# EAGLE schematic ultra-flowmeter (EAGLE 9.6.2)
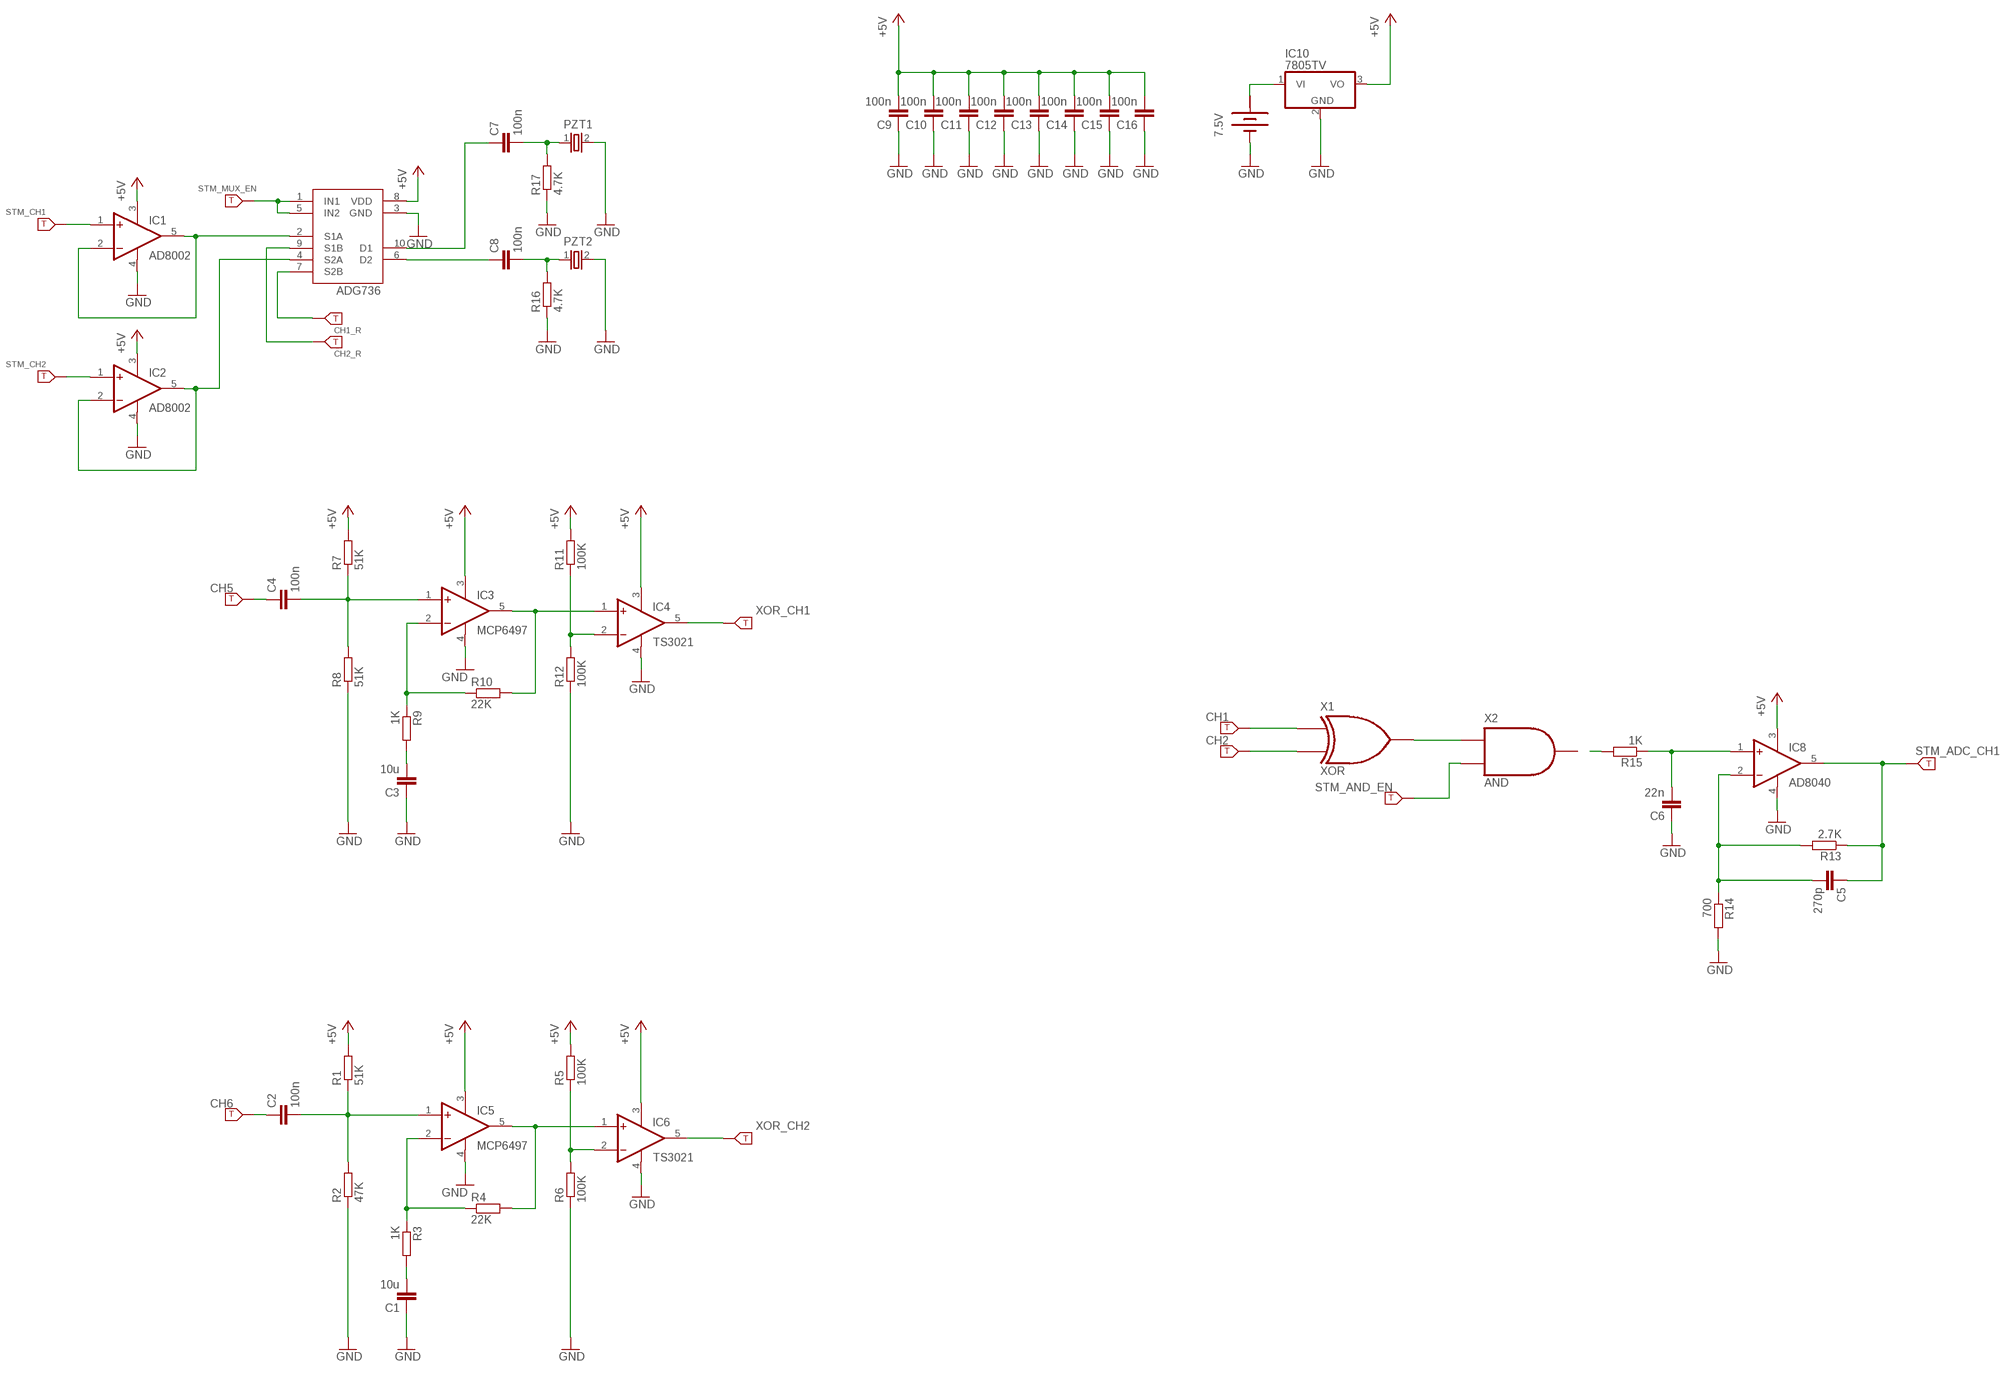
[diagram p0: schematic, sheet 1]

## Parts
7.5V  BATTERY  [BATTERY]
ADG736  ADG736  [MSOP10]
C1  10u  C-EU025-025X050  [C025-025X050]
C2  100n  C-EU025-025X050  [C025-025X050]
C3  10u  C-EU025-025X050  [C025-025X050]
C4  100n  C-EU025-025X050  [C025-025X050]
C5  270p  C-EU025-025X050  [C025-025X050]
C6  22n  C-EU025-025X050  [C025-025X050]
C7  100n  C-EU025-025X050  [C025-025X050]
C8  100n  C-EU025-025X050  [C025-025X050]
C9  100n  C-EU025-025X050  [C025-025X050]
C10  100n  C-EU025-025X050  [C025-025X050]
C11  100n  C-EU025-025X050  [C025-025X050]
C12  100n  C-EU025-025X050  [C025-025X050]
C13  100n  C-EU025-025X050  [C025-025X050]
C14  100n  C-EU025-025X050  [C025-025X050]
C15  100n  C-EU025-025X050  [C025-025X050]
C16  100n  C-EU025-025X050  [C025-025X050]
CH1  PAD1  [PAD1]
CH1_R  PAD1  [PAD1]
CH2  PAD1  [PAD1]
CH2_R  PAD1  [PAD1]
CH5  PAD1  [PAD1]
CH6  PAD1  [PAD1]
IC1  AD8002  [SO8]
IC2  AD8002  [SO8]
IC3  MCP6497  [SO8]
IC4  TS3021  [SO8]
IC5  MCP6497  [SO8]
IC6  TS3021  [SO8]
IC8  AD8040  [SO8]
IC10  7805TV  [TO220V]
PZT1  CRYSTAL  [CRYSTAL]
PZT2  CRYSTAL  [CRYSTAL]
R1  51K  R-EU_0207/10  [0207/10]
R2  47K  R-EU_0207/10  [0207/10]
R3  1K  R-EU_0207/10  [0207/10]
R4  22K  R-EU_0207/10  [0207/10]
R5  100K  R-EU_0207/10  [0207/10]
R6  100K  R-EU_0207/10  [0207/10]
R7  51K  R-EU_0207/10  [0207/10]
R8  51K  R-EU_0207/10  [0207/10]
R9  1K  R-EU_0207/10  [0207/10]
R10  22K  R-EU_0207/10  [0207/10]
R11  100K  R-EU_0207/10  [0207/10]
R12  100K  R-EU_0207/10  [0207/10]
R13  2.7K  R-EU_0207/10  [0207/10]
R14  700  R-EU_0207/10  [0207/10]
R15  1K  R-EU_0207/10  [0207/10]
R16  4.7K  R-EU_0207/10  [0207/10]
R17  4.7K  R-EU_0207/10  [0207/10]
STM_ADC_CH1  PAD1  [PAD1]
STM_AND_EN  PAD1  [PAD1]
STM_CH1  PAD1  [PAD1]
STM_CH2  PAD1  [PAD1]
STM_MUX_EN  PAD1  [PAD1]
X1  XOR  (no package)
X2  AND  (no package)
XOR_CH1  PAD1  [PAD1]
XOR_CH2  PAD1  [PAD1]

## Nets
+5V: ADG736.8(VDD) C9.2 C10.2 C11.2 C12.2 C13.2 C14.2 C15.2 C16.2 IC1.3(OFF1) IC2.3(OFF1) IC3.3(OFF1) IC4.3(OFF1) IC5.3(OFF1) IC6.3(OFF1) IC8.3(OFF1) IC10.3(VO) R1.2 R5.2 R7.2 R11.2
GND: 7.5V.- ADG736.3(GND) C1.1 C3.1 C6.1 C9.1 C10.1 C11.1 C12.1 C13.1 C14.1 C15.1 C16.1 IC1.4(OFF2) IC2.4(OFF2) IC3.4(OFF2) IC4.4(OFF2) IC5.4(OFF2) IC6.4(OFF2) IC8.4(OFF2) IC10.2(GND) PZT1.2 PZT2.2 R2.1 R6.1 R8.1 R12.1 R14.2 R16.1 R17.1
N$1: C2.2 IC5.1(+IN) R1.1 R2.2
N$2: IC2.1(+IN) STM_CH2.1
N$3: IC5.2(-IN) R3.1 R4.1
N$4: IC5.5(OUT) IC6.1(+IN) R4.2
N$5: IC6.2(-IN) R5.1 R6.2
N$6: C4.2 IC3.1(+IN) R7.1 R8.2
N$7: IC3.2(-IN) R9.1 R10.1
N$8: IC3.5(OUT) IC4.1(+IN) R10.2
N$9: IC4.2(-IN) R11.1 R12.2
N$10: C3.2 R9.2
N$11: C6.2 IC8.1(+IN) R15.1
N$12: R15.2
N$13: C5.2 IC8.2(-IN) R13.2 R14.1
N$14: C5.1 IC8.5(OUT) R13.1 STM_ADC_CH1.1
N$15: ADG736.2(S1A) IC1.2(-IN) IC1.5(OUT)
N$16: ADG736.4(S2A) IC2.2(-IN) IC2.5(OUT)
N$17: C7.2 PZT1.1 R17.2
N$18: ADG736.6(D2) C8.1
N$19: C8.2 PZT2.1 R16.2
N$20: ADG736.10(D1) C7.1
N$21: X1.Y X2.A
N$22: STM_AND_EN.1 X2.B
N$24: IC1.1(+IN) STM_CH1.1
N$25: C1.2 R3.2
N$26: IC4.5(OUT) XOR_CH1.1
N$27: CH1.1 X1.A
N$28: 7.5V.+ IC10.1(VI)
N$29: C4.1 CH5.1
N$30: IC6.5(OUT) XOR_CH2.1
N$31: ADG736.9(S1B) CH2_R.1
N$32: ADG736.7(S2B) CH1_R.1
N$33: CH2.1 X1.B
N$34: C2.1 CH6.1
STM_MUX_EN: ADG736.1(IN1) ADG736.5(IN2) STM_MUX_EN.1
Unconnected: X2.Y

## Power pins joined to a net without a drawn wire
+: 7.5V.+@1(+)

## Library data of the parts
7.5V = special:BATTERY: BATTERY
ADG736 = ultralab:ADG736: DUAL SPDT Switch
C1-C16 = rcl:C-EU: CAPACITOR, European symbol; SPICEPREFIX: C
CH1 CH1_R CH2 CH2_R CH5 CH6 STM_ADC_CH1 STM_AND_EN STM_CH1 STM_CH2 STM_MUX_EN XOR_CH1 XOR_CH2 = ultralab:PAD1
IC1 IC2 = ultra_meter:AD8002
IC3 IC5 = ultra_meter:MCP6497
IC4 IC6 = ultra_meter:TS3021
IC8 = ultra_meter:AD8040
IC10 = linear:78*: Positive VOLTAGE REGULATOR Source: http://cache.national.com/ds/LM/LM78L05.pdf http://www.fairchildsemi.com/ds/LM/LM7805.pdf
PZT1 PZT2 = ultralab:CRYSTAL
R1-R17 = rcl:R-EU_: RESISTOR, European symbol; SPICEPREFIX: R
X1 = ngspice-digital:XOR: 2 input XOR gate
X2 = ngspice-digital:AND: 2 input logic AND gate